# EAGLE design slew rate control (EAGLE 6.2)
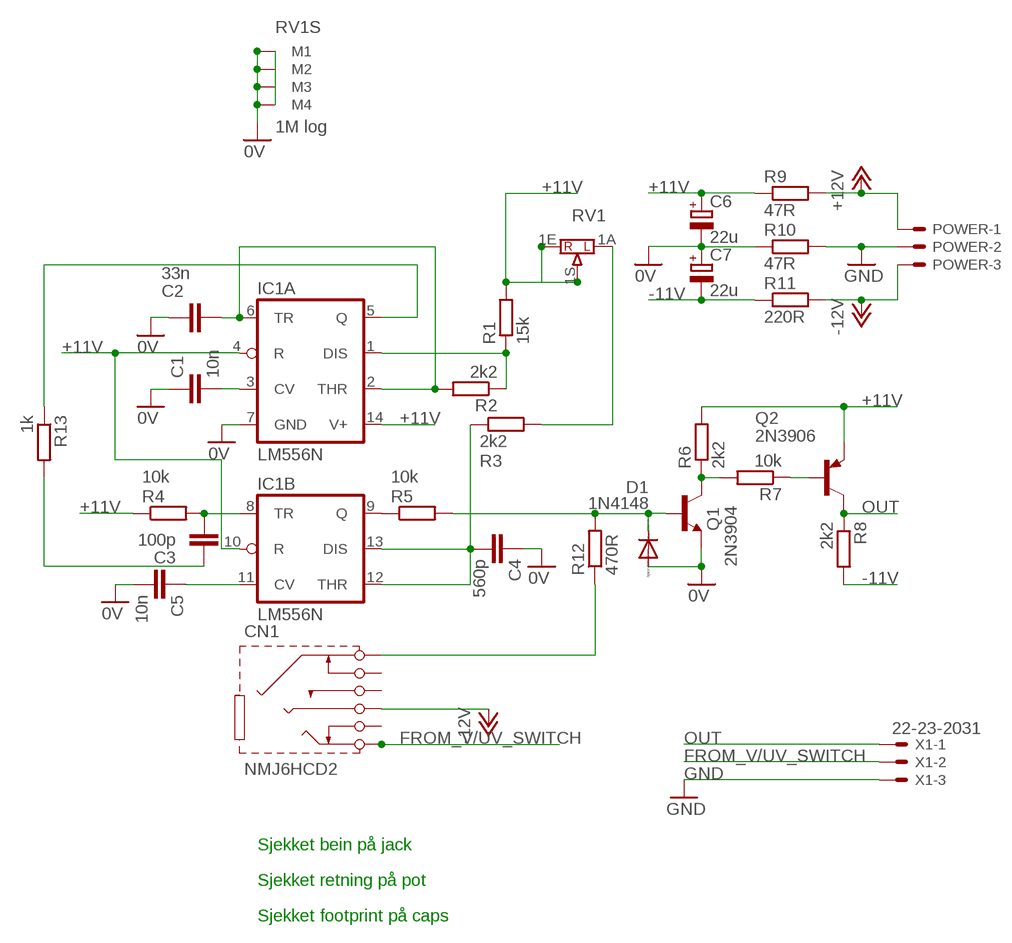
[diagram p0: schematic, sheet 1]

## Parts
C1  10n  C-EU025-025X050  [C025-025X050]
C2  33n  C-EU075-032X103  [C075-032X103]
C3  100p  C-EU025-025X050  [C025-025X050]
C4  560p  C-EU025_050-025X075  [C025_050-025X075]
C5  10n  C-EU025-025X050  [C025-025X050]
C6  22u  CPOL-EUE2.5-5  [E2,5-5]
C7  22u  CPOL-EUE2.5-5  [E2,5-5]
CN1  NMJ6HCD2  [NMJ6HCD2]
D1  1N4148  1N4148DOJ35-5  [DO35-5J]
IC1  LM556N  [DIL14]
POWER  KK-156-3  [KK-156-3]
Q1  2N3904  [TO92]
Q2  2N3906  [TO92]
R1  15k  R-EU_0207/7  [0207/7]
R2  2k2  R-EU_0207/7  [0207/7]
R3  2k2  R-EU_0207/7  [0207/7]
R4  10k  R-EU_0207/7  [0207/7]
R5  10k  R-EU_0207/7  [0207/7]
R6  2k2  R-EU_0207/7  [0207/7]
R7  10k  R-EU_0207/7  [0207/7]
R8  2k2  R-EU_0207/7  [0207/7]
R9  47R  R-EU_0207/7  [0207/7]
R10  47R  R-EU_0207/7  [0207/7]
R11  220R  R-EU_0207/7  [0207/7]
R12  470R  R-EU_0207/7  [0207/7]
R13  1k  R-EU_0207/7  [0207/7]
RV1  1M log  POT16_W_BRACKET""  [POT16_W_BRACKET]
X1  22-23-2031  [22-23-2031]

## Nets
0V: C1.1 C2.2 C4.1 C5.2 C6.- C7.+ D1.A IC1.7(A:GND) Q1.3(E) R10.1 RV1.M1 RV1.M2 RV1.M3 RV1.M4
+11V: C6.+ IC1.4(A:R) IC1.10(B:R) IC1.14(A:V+) Q2.3(E) R1.2 R4.1 R6.2 R9.1 RV1.1E RV1.1S
+12V: POWER.1 R9.2
-11V: C7.- R8.2 R11.1
-12V: CN1.R(RING) POWER.3 R11.2
FROM_V/UV_SWITCH: CN1.T(TIP) X1.2
GND: POWER.2 R10.2 X1.3
N$1: C3.2 IC1.8(B:TR) R4.2
N$2: C2.1 IC1.2(A:THR) IC1.6(A:TR) R2.2
N$3: C5.1 IC1.11(B:CV)
N$4: IC1.9(B:Q) R5.1
N$5: C4.2 IC1.12(B:THR) IC1.13(B:DIS) R3.1
N$6: C3.1 R13.2
N$7: IC1.5(A:Q) R13.1
N$8: R3.2 RV1.1A
N$9: IC1.1(A:DIS) R1.1 R2.1
N$10: C1.2 IC1.3(A:CV)
N$12: D1.C Q1.2(B) R5.2 R12.2
N$13: CN1.S(SLEEVE) R12.1
N$14: Q1.1(C) R6.1 R7.2
N$15: Q2.2(B) R7.1
OUT: Q2.1(C) R8.1 X1.1
Unconnected: CN1.RN(RING-S) CN1.SN(SLEEVE-S) CN1.TN(TIP-S)

## Notes on the sheet
- Sjekket bein på jack
- Sjekket retning på pot
- Sjekket footprint på caps

## Library data of the parts
C1-C5 = resistor:C-EU: CAPACITOR, European symbol
C6 C7 = resistor:CPOL-EU: POLARIZED CAPACITOR, European symbol
CN1 = audio:NMJ6HCD2: M-Series 1/4" Mono Phone Connector
D1 = joakim:1N4148: DIODE high speed (Philips)
IC1 = linear:*556: Dual TIMER
POWER = con-molex:KK-156-3: KK 156 HEADER Source: http://www.molex.com/pdm_docs/sd/026604100_sd.pdf; OC_FARNELL: unknown; OC_NEWARK: unknown
Q1 = transistor:2N3904: NPN TRANSISTOR
Q2 = transistor-pnp:2N3906: PNP Transistor
R1-R13 = resistor:R-EU_: RESISTOR, European symbol
RV1 = joakim:POT16_W_BRACKET: POTENTIOMETER potentiometer, 16 mm w 5mm pitch and OMEG bracket, 17,8 x 7,5 mm
X1 = con-molex:22-23-2031: .100" (2.54mm) Center Header - 3 Pin; MF: MOLEX; MPN: 22-23-2031; OC_FARNELL: 1462950; OC_NEWARK: 30C0862

## Board
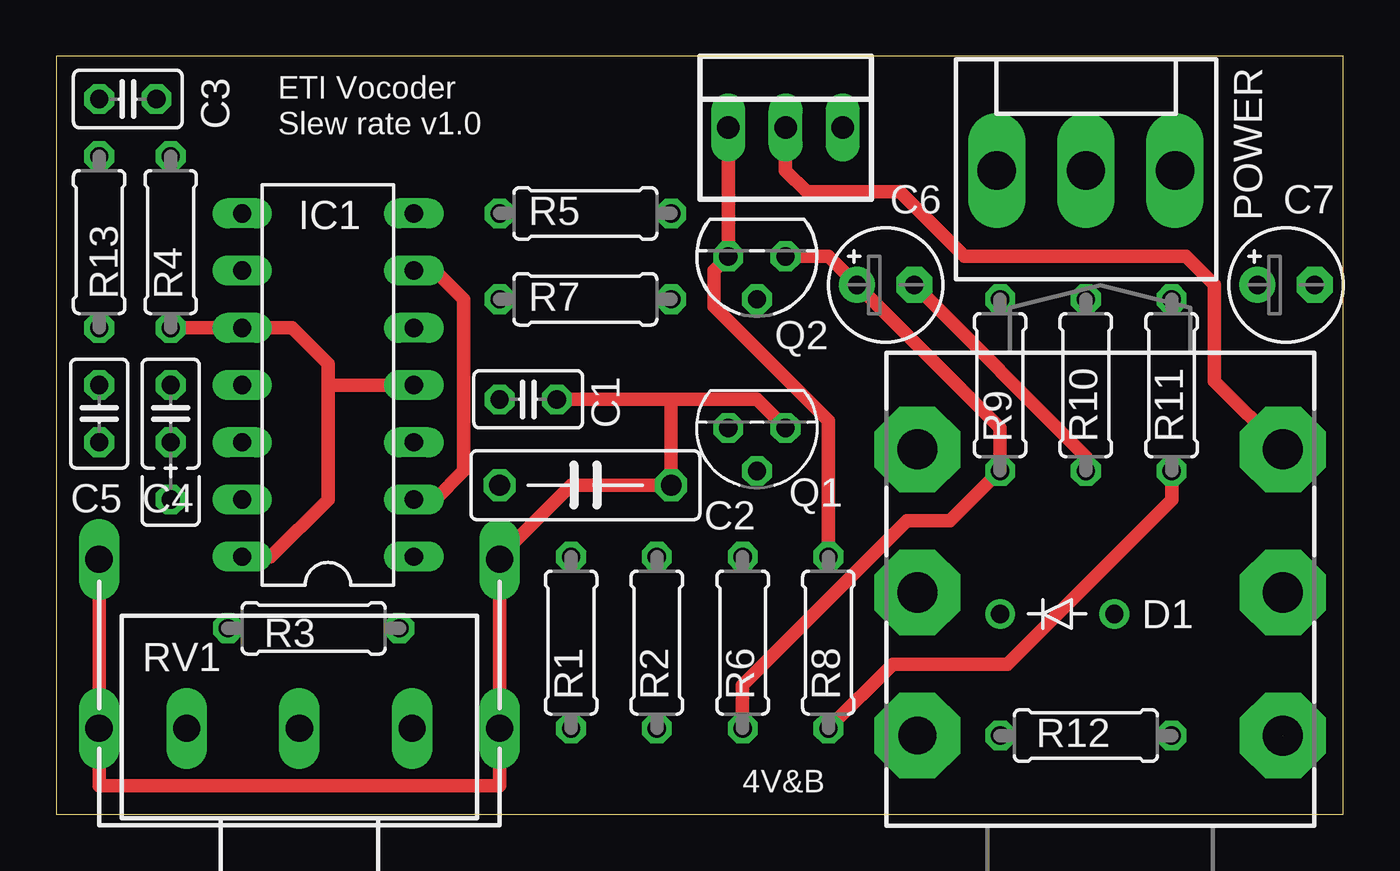
[diagram p1: board, top side]
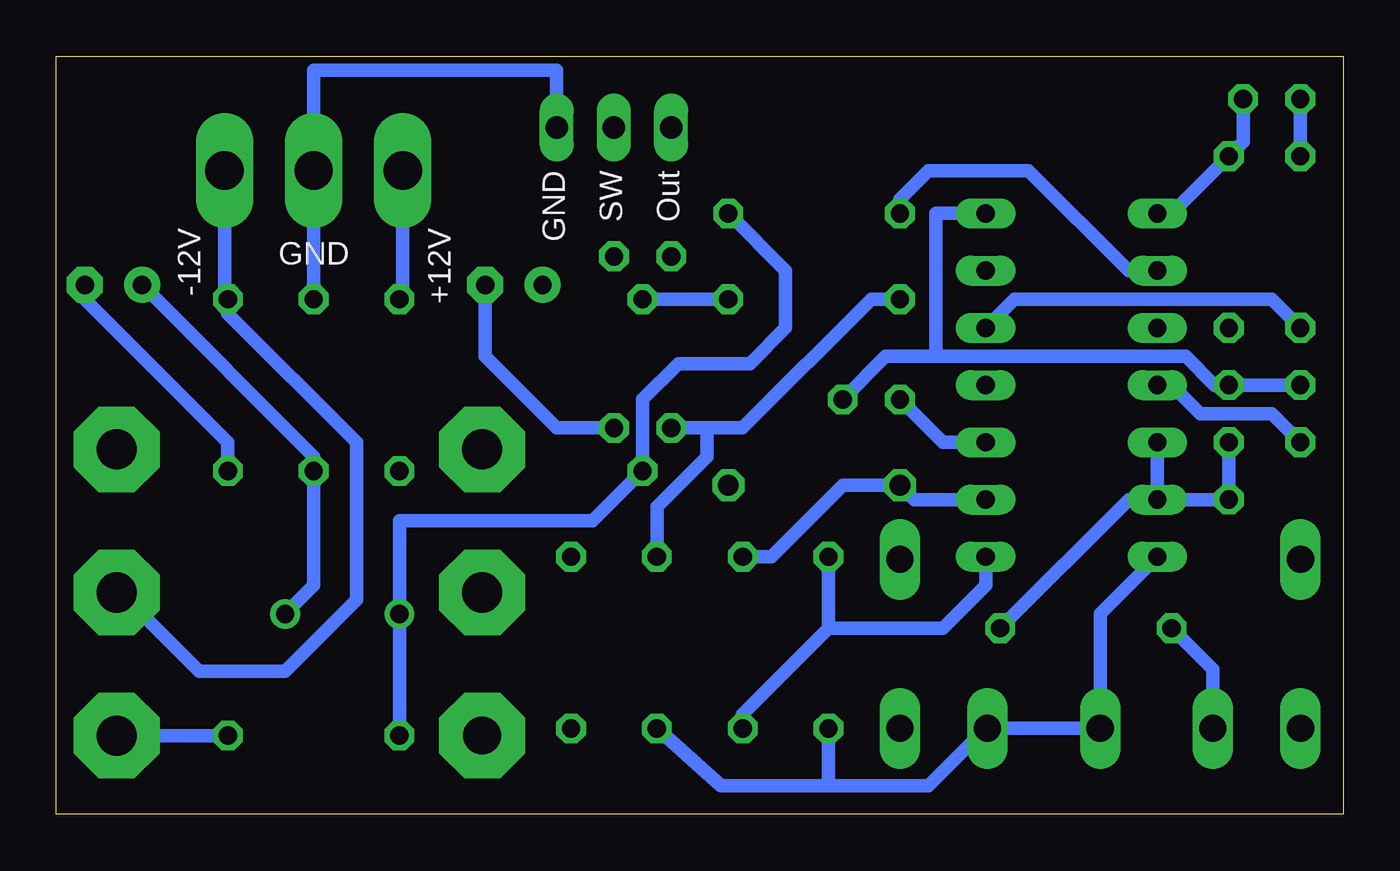
[diagram p2: board, bottom side, seen from below]

Size 57.15 x 33.65 mm. Coordinates in mm from the lower left corner, seen from the top.
Outline: 0,0 57.15,0 57.15,33.65 0,33.65 0,0
Copper layers (1*16): Top 0.035mm / dielectric 1.5mm / Bottom 0.035mm
Design rules: minimum track width 10mil, minimum drill 24mil, track to track 8mil, track to pad 8mil, pad to pad 8mil, via to via 8mil, smd to smd 8mil, copper to edge 40mil, drill to drill 8mil, minimum pad ring 10mil, minimum via ring 8mil, stop-mask expansion 4mil, vias tented up to drill 0mil, thermal gap 10mil

### Footprints (pad centres in the part's own frame; a part is rotated, then mirrored left to right if it is on the bottom)
C025-025X050 = drill 0.813 octagon: 1 -1.27,0; 2 1.27,0
C075-032X103 = drill 0.914 octagon: 1 -3.81,0; 2 3.81,0
C025_050-025X075 = drill 0.813 octagon: 1 -1.27,0; 2 1.27,0; 3 3.81,0
E2,5-5 = drill 0.813 pad 1.6: + -1.27,0 | drill 0.813 pad 1.6 octagon: - 1.27,0
NMJ6HCD2 = drill 1.778 pad 3.81 octagon: R -10.35,8.115; RN -10.35,-8.115; S -4,8.115; T -16.7,8.115; TN -16.7,-8.115 | drill 1.676 pad 3.81 octagon: SN -4,-8.115
DO35-5J = drill 0.813: A 2.54,0; C -2.54,0
DIL14 = drill 0.813 long: 1 -7.62,-3.81; 2 -5.08,-3.81; 3 -2.54,-3.81; 4 0,-3.81; 5 2.54,-3.81; 6 5.08,-3.81; 7 7.62,-3.81; 8 7.62,3.81; 9 5.08,3.81; 10 2.54,3.81; 11 0,3.81; 12 -2.54,3.81; 13 -5.08,3.81; 14 -7.62,3.81
KK-156-3 = drill 1.7 pad 2.184 long: 1 -3.96,0; 2 0,0; 3 3.96,0
TO92 = drill 0.813 octagon: 1 1.27,0; 2 0,1.905; 3 -1.27,0
0207/7 = drill 0.813 octagon: 1 -3.81,0; 2 3.81,0
POT16_W_BRACKET = drill 1.2 long: 1A -5,0; 1E 5,0; 1S 0,0; M1 -8.9,0; M2 8.9,0; M3 8.9,7.5; M4 -8.9,7.5
22-23-2031 = drill 1 long: 1 -2.54,0; 2 0,0; 3 2.54,0

### Placement (x,y rotation side)
C1  20.95,18.41 180 top
C2  23.5,14.61 0 top
C3  3.17,31.75 0 top
C4  5.08,17.78 270 top
C5  1.91,17.78 90 top
C6  36.83,23.5 0 top
C7  54.61,23.5 0 top
CN1  46.35,-0.51 270 top
D1  44.45,8.89 0 top
IC1  12.06,19.05 90 top
POWER  45.72,28.57 0 top
Q1  31.11,17.14 180 top
Q2  31.11,24.77 180 top
R1  22.86,7.62 270 top
R2  26.67,7.62 90 top
R3  11.43,8.26 180 top
R4  5.08,25.4 90 top
R5  23.5,26.67 0 top
R6  30.48,7.62 270 top
R7  23.5,22.86 180 top
R8  34.29,7.62 270 top
R9  41.91,19.05 90 top
R10  45.72,19.05 90 top
R11  49.53,19.05 90 top
R12  45.72,3.49 180 top
R13  1.91,25.4 90 top
RV1  10.79,3.81 0 top
X1  32.38,30.48 0 top

### Tracks (layer width: path | path; a pad name or v marks a point on that pad's centre or on a via)
0V
  Top 0.61: RV1.M1 RV1.M4 1.9,1.28 1.91,1.27 19.68,1.27 19.68,3.8 RV1.M2 RV1.M3 19.7,11.42 19.68,11.43 22.86,14.61 C2.2 27.3,18.41 | R10.1 45.72,15.88 C6.- | Q1.3 31.11,18.41 27.3,18.41 | C1.1 27.3,18.41
  Bottom 0.61: C5.2 C4.1 5.71,19.05 6.99,20.32 18.1,20.32 | 18.1,20.32 18.1,26.67 IC1.7 | 18.1,20.32 20.32,20.32 C1.1 | C6.- 38.1,20.32 34.92,17.14 Q1.3 | C7.+ 45.72,15.88 R10.1 45.72,10.16 D1.A
+11V
  Top 0.61: R4.1 IC1.10 10.48,21.59 12.06,20 12.06,19.05 | 12.06,19.05 12.06,13.97 9.53,11.43 IC1.14 | R6.2 30.48,5.71 37.78,13.02 39.69,13.02 R9.1 41.91,17.14 C6.+ 34.29,24.77 Q2.3 | IC1.4 12.06,19.05
  Bottom 0.61: IC1.14 10.79,8.89 RV1.1S RV1.1E 15.88,3.81 18.41,1.27 22.86,1.27 | 22.86,1.27 R1.2 | R6.2 27.62,1.27 22.86,1.27
+12V
  Bottom 0.61: POWER.1 41.76,23.01 R9.2
-11V
  Top 0.61: R8.2 37.15,6.67 42.23,6.67 49.53,13.97 R11.1
  Bottom 0.61: C7.- 55.88,22.86 49.53,16.51 R11.1
-12V
  Bottom 0.61: POWER.3 49.68,23.01 R11.2 49.53,22.23 43.81,16.51 43.81,9.53 46.99,6.35 50.8,6.35 53.98,9.53 CN1.R
FROM_V/UV_SWITCH
  Top 0.61: X1.2 32.38,28.57 33.34,27.62 37.47,27.62 40.32,24.77 50.16,24.77 51.44,23.5 51.44,19.23 CN1.T
GND
  Bottom 0.61: R10.2 POWER.2 45.72,33.02 34.92,33.02 X1.3
N$1
  Bottom 0.61: C3.2 4.45,29.84 R4.2 7.62,26.67 IC1.8
N$2
  Top 0.61: IC1.6 16.83,24.13 18.1,22.86 18.1,15.24 16.83,13.97 IC1.2
  Bottom 0.61: IC1.2 19.05,13.97 C2.1 22.23,14.61 25.4,11.43 R2.2
N$3
  Bottom 0.61: IC1.11 7.62,19.05 6.35,17.78 3.17,17.78 C5.1
N$4
  Bottom 0.61: IC1.9 9.53,24.13 13.97,28.57 18.41,28.57 19.68,27.3 R5.1
N$5
  Bottom 0.61: IC1.12 IC1.13 | R3.1 9.53,13.97 IC1.13 | C4.2 5.08,13.97 IC1.13
N$6
  Bottom 0.61: R13.2 C3.1
N$7
  Bottom 0.61: R13.1 3.17,22.86 14.61,22.86 IC1.5
N$8
  Bottom 0.61: RV1.1A 5.79,6.43 R3.2
N$9
  Bottom 0.61: IC1.1 15.88,10.16 17.78,8.26 22.86,8.26 | 22.86,8.26 R1.1 | R2.1 26.67,4.45 22.86,8.26
N$10
  Bottom 0.61: IC1.3 17.78,16.51 C1.2
N$12
  Bottom 0.61: R5.2 24.77,24.13 24.77,21.59 26.35,20 29.53,20 31.11,18.41 Q1.2 33.34,13.02 41.91,13.02 D1.C R12.2
N$13  (1 unrouted)
  Bottom 0.61: R12.1 CN1.S
N$14
  Bottom 0.61: R7.2 20.95,22.86 26.67,17.14 28.26,17.14 | R6.1 30.48,13.65 28.26,15.88 28.26,17.14 | 28.26,17.14 Q1.1
N$15
  Bottom 0.61: R7.1 Q2.2
OUT
  Top 0.61: R8.1 34.29,17.46 29.21,22.54 29.21,24.13 Q2.1 X1.1

### Text on the board
tNames: ETI Vocoder | Slew rate v1.0 | 4V&B
bNames: Out | SW | GND | +12V | -12V | GND